# EAGLE design moc (EAGLE 8.6.2)
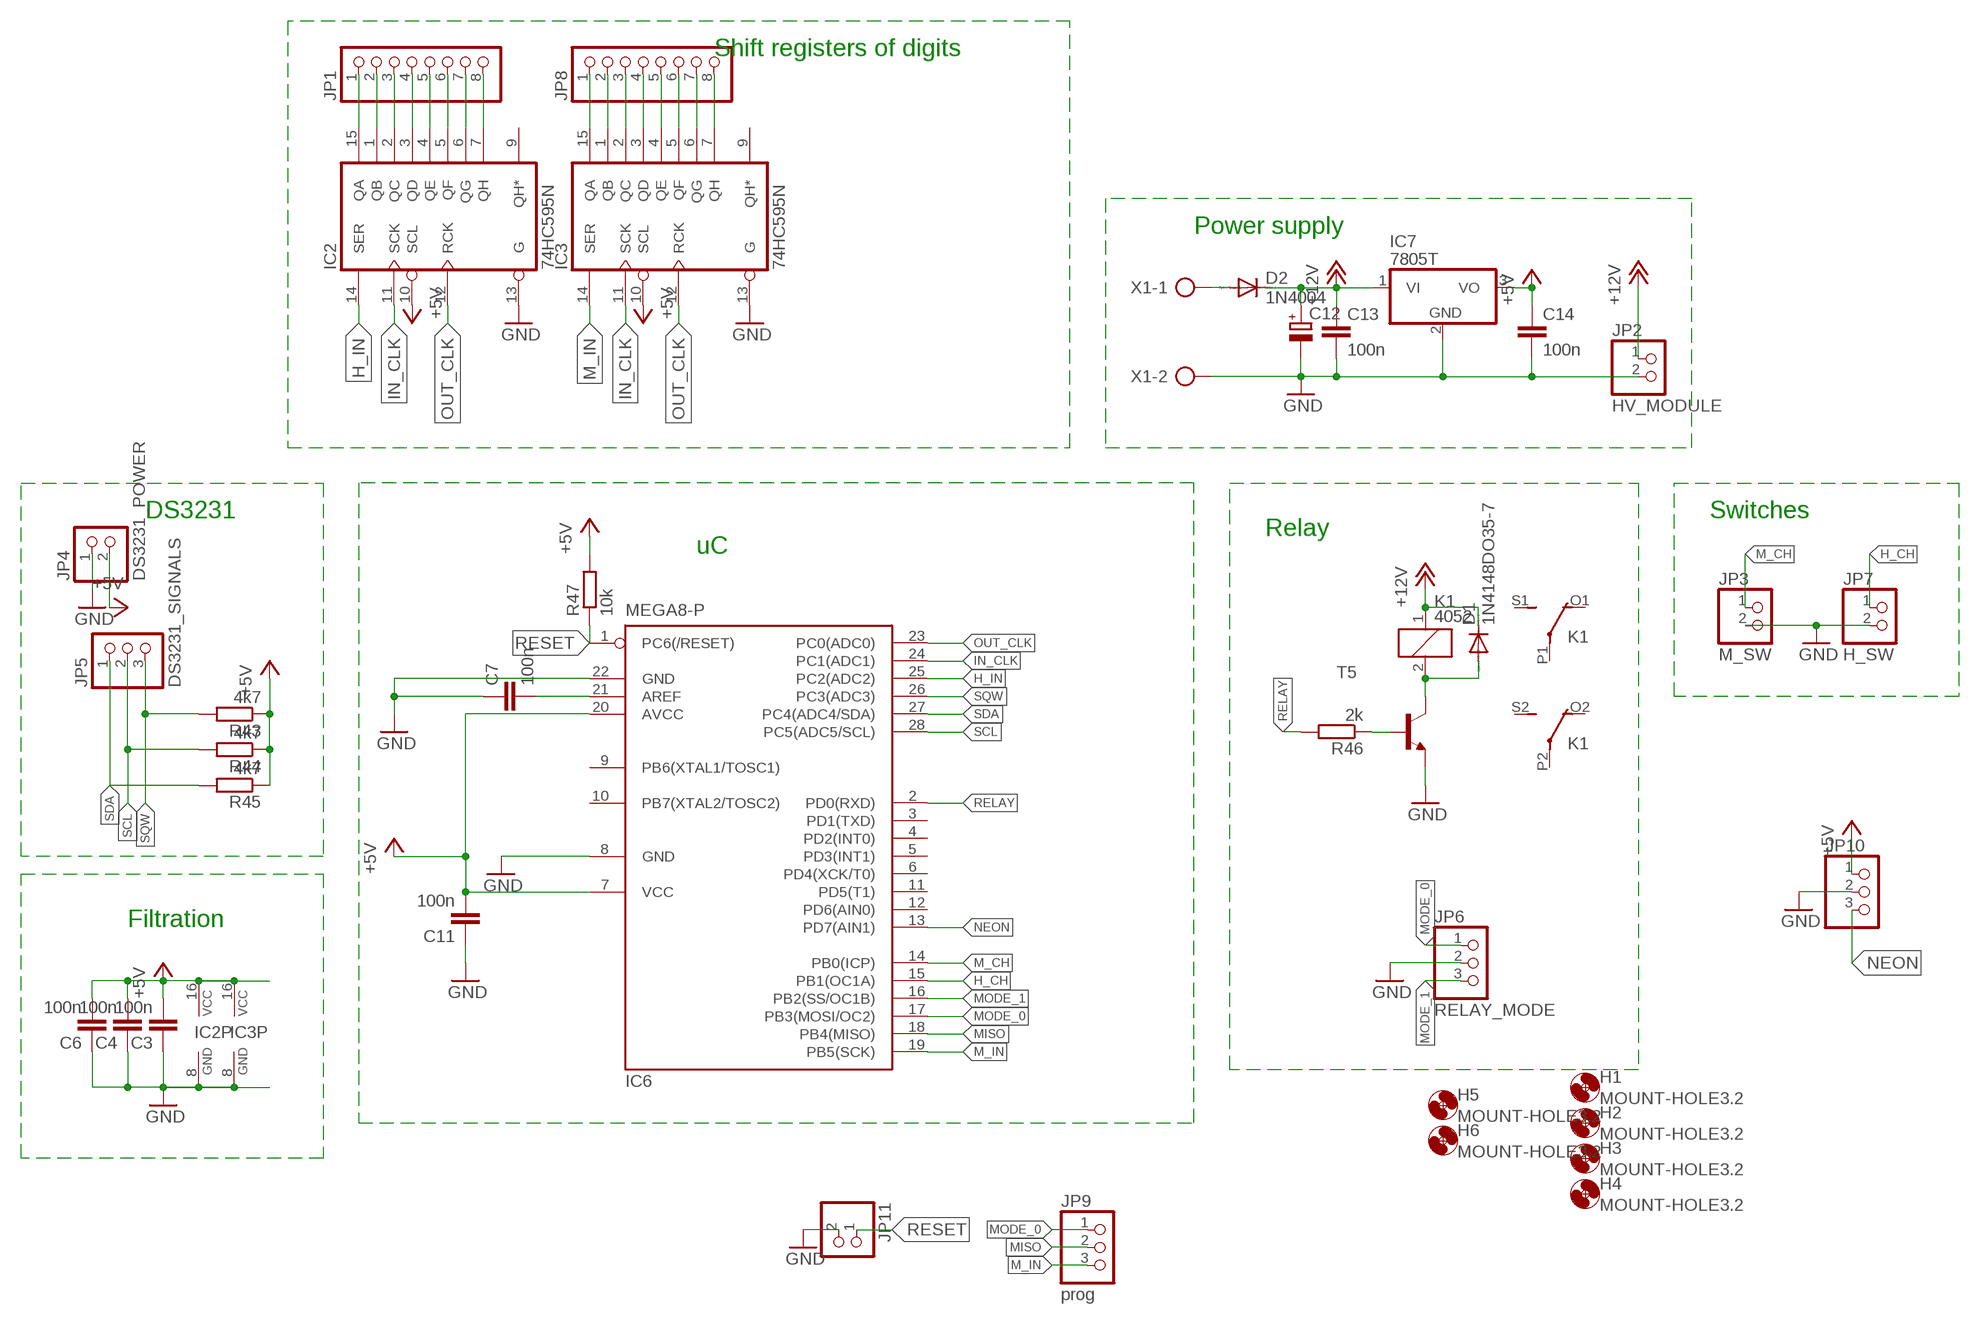
[diagram p0: schematic, sheet 1]

## Parts
C3  100n  C-EU025-025X050  [C025-025X050]
C4  100n  C-EU025-025X050  [C025-025X050]
C6  100n  C-EU025-025X050  [C025-025X050]
C7  100n  C-EU025-025X050  [C025-025X050]
C11  100n  C-EU025-025X050  [C025-025X050]
C12  CPOL-EUE3.5-8  [E3,5-8]
C13  100n  C-EU025-025X050  [C025-025X050]
C14  100n  C-EU025-025X050  [C025-025X050]
D1  1N4148DO35-7  [DO35-7]
D2  1N4004  [DO41-10]
H1  MOUNT-HOLE3.2  [3,2]
H2  MOUNT-HOLE3.2  [3,2]
H3  MOUNT-HOLE3.2  [3,2]
H4  MOUNT-HOLE3.2  [3,2]
H5  MOUNT-HOLE3.2  [3,2]
H6  MOUNT-HOLE3.2  [3,2]
IC2  74HC595N  [DIL16]
IC3  74HC595N  [DIL16]
IC6  MEGA8-P  [DIL28-3]
IC7  7805T  [TO220H]
JP1  PINHD-1X8  [1X08]
JP2  HV_MODULE  PINHD-1X2  [1X02]
JP3  M_SW  PINHD-1X2  [1X02]
JP4  DS3231_POWER  PINHD-1X2  [1X02]
JP5  DS3231_SIGNALS  PINHD-1X3  [1X03]
JP6  RELAY_MODE  PINHD-1X3  [1X03]
JP7  H_SW  PINHD-1X2  [1X02]
JP8  PINHD-1X8  [1X08]
JP9  prog  PINHD-1X3  [1X03]
JP10  PINHD-1X3  [1X03]
JP11  PINHD-1X2/90  [1X02/90]
K1  4052  [F4052]
R43  4k7  R-EU_0207/10  [0207/10]
R44  4k7  R-EU_0207/10  [0207/10]
R45  4k7  R-EU_0207/10  [0207/10]
R46  2k  R-EU_0207/7  [0207/7]
R47  10k  R-EU_0207/10  [0207/10]
T5  BC337-16-NPN-TO92-CBE  [TO92-CBE]
X1  AK300/2  [AK300/2]

## Nets
+5V: C3.2 C4.2 C6.2 C11.2 C14.1 IC2.10(SCL) IC2.16(VCC) IC3.10(SCL) IC3.16(VCC) IC6.7(VCC) IC6.20(AVCC) IC7.3(VO) JP4.2 JP10.1 R43.1 R44.1 R45.1 R47.2
+12V: C12.+ C13.1 D1.C D2.C IC7.1(VI) JP2.1 K1.1
D8: IC3.7(QH) JP8.8
D9: IC3.6(QG) JP8.7
D10: IC3.5(QF) JP8.6
D11: IC3.4(QE) JP8.5
D12: IC3.3(QD) JP8.4
D13: IC3.2(QC) JP8.3
D14: IC3.1(QB) JP8.2
D15: IC3.15(QA) JP8.1
D16: IC2.7(QH) JP1.8
D17: IC2.6(QG) JP1.7
D18: IC2.5(QF) JP1.6
D19: IC2.4(QE) JP1.5
D20: IC2.3(QD) JP1.4
D21: IC2.2(QC) JP1.3
D22: IC2.1(QB) JP1.2
D23: IC2.15(QA) JP1.1
GND: C3.1 C4.1 C6.1 C7.1 C11.1 C12.- C13.2 C14.2 IC2.8(GND) IC2.13(G) IC3.8(GND) IC3.13(G) IC6.8(GND) IC6.22(GND) IC7.2(GND) JP2.2 JP3.2 JP4.1 JP6.2 JP7.2 JP10.2 JP11.2 T5.E X1.2
H_CH: IC6.15(PB1(OC1A)) JP7.1
H_IN: IC2.14(SER) IC6.25(PC2(ADC2))
IN_CLK: IC2.11(SCK) IC3.11(SCK) IC6.24(PC1(ADC1))
M_CH: IC6.14(PB0(ICP)) JP3.1
M_IN: IC3.14(SER) IC6.19(PB5(SCK)) JP9.3
MISO: IC6.18(PB4(MISO)) JP9.2
MODE_0: IC6.17(PB3(MOSI/OC2)) JP6.1 JP9.1
MODE_1: IC6.16(PB2(SS/OC1B)) JP6.3
N$11: D2.A X1.1
N$43: C7.2 IC6.21(AREF)
N$53: D1.A K1.2 T5.C
N$54: R46.1 T5.B
NEON: IC6.13(PD7(AIN1)) JP10.3
OUT_CLK: IC2.12(RCK) IC3.12(RCK) IC6.23(PC0(ADC0))
RELAY: IC6.2(PD0(RXD)) R46.2
RESET: IC6.1(PC6(/RESET)) JP11.1 R47.1
SCL: IC6.28(PC5(ADC5/SCL)) JP5.2 R44.2
SDA: IC6.27(PC4(ADC4/SDA)) JP5.1 R45.2
SQW: IC6.26(PC3(ADC3)) JP5.3 R43.2
Unconnected: IC2.9(QH*) IC3.9(QH*) IC6.3(PD1(TXD)) IC6.4(PD2(INT0)) IC6.5(PD3(INT1)) IC6.6(PD4(XCK/T0)) IC6.9(PB6(XTAL1/TOSC1)) IC6.10(PB7(XTAL2/TOSC2)) IC6.11(PD5(T1)) IC6.12(PD6(AIN0)) K1.O1(2:O) K1.O2(3:O) K1.P1(2:P) K1.P2(3:P) K1.S1(2:S) K1.S2(3:S)

## Notes on the sheet
- Shift registers of digits
- Power supply
- DS3231 | Switches
- Relay
- uC
- Filtration

## Library data of the parts
C3 C4 C6 C7 C11 C13 C14 = resistor:C-EU: CAPACITOR, European symbol
C12 = resistor:CPOL-EU: POLARIZED CAPACITOR, European symbol
D1 = diode:1N4148: DIODE high speed (Philips)
D2 = diode:1N4004: DIODE general purpose rectifier, 1 A
H1-H6 = holes:MOUNT-HOLE: MOUNTING HOLE with drill center marker
IC2 IC3 = 74xx-eu:74*595: 8-bit SHIFT REGISTER, output latch
IC6 = atmel:MEGA8-P: MICROCONTROLLER 8 Kbytes FLASH, 1 kbytes SRAM, 512 bytes EEPROM, USART, 4-channel 10 bit ADC, 2-channel 8 bit ADC Pin compatible with Atmega48, ATMega88, ATMega168 Source: avr.lbr; OC_FARNELL: unknown; OC_NEWARK: unknown
IC7 = linear:78*: Positive VOLTAGE REGULATOR Source: http://cache.national.com/ds/LM/LM78L05.pdf http://www.fairchildsemi.com/ds/LM/LM7805.pdf
JP1 JP8 = pinhead:PINHD-1X8: PIN HEADER
JP2-JP4 JP7 JP11 = pinhead:PINHD-1X2: PIN HEADER
JP5 JP6 JP9 JP10 = pinhead:PINHD-1X3: PIN HEADER
K1 = relay:4052: RELAY 2 x switch, Finder; OC_FARNELL: unknown; OC_NEWARK: unknown
R43-R47 = resistor:R-EU_: RESISTOR, European symbol
T5 = transistor:*-NPN-: NPN Transistror BF959 corrected 2008.03.06
X1 = con-ptr500:AK300/2: CONNECTOR; OC_FARNELL: unknown; OC_NEWARK: unknown

## Board
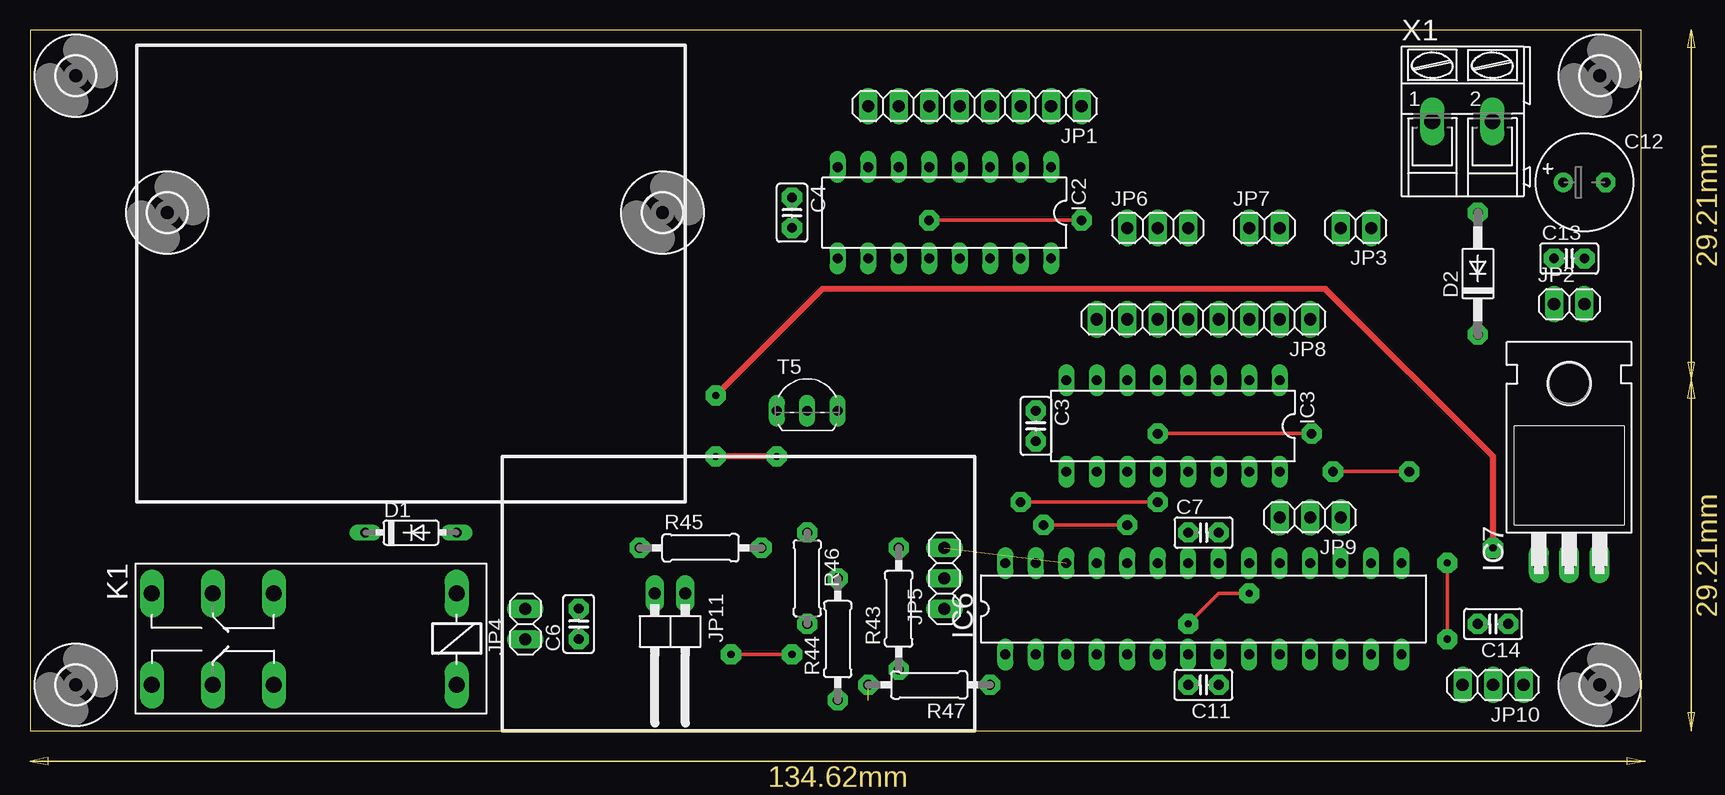
[diagram p1: board, top side]
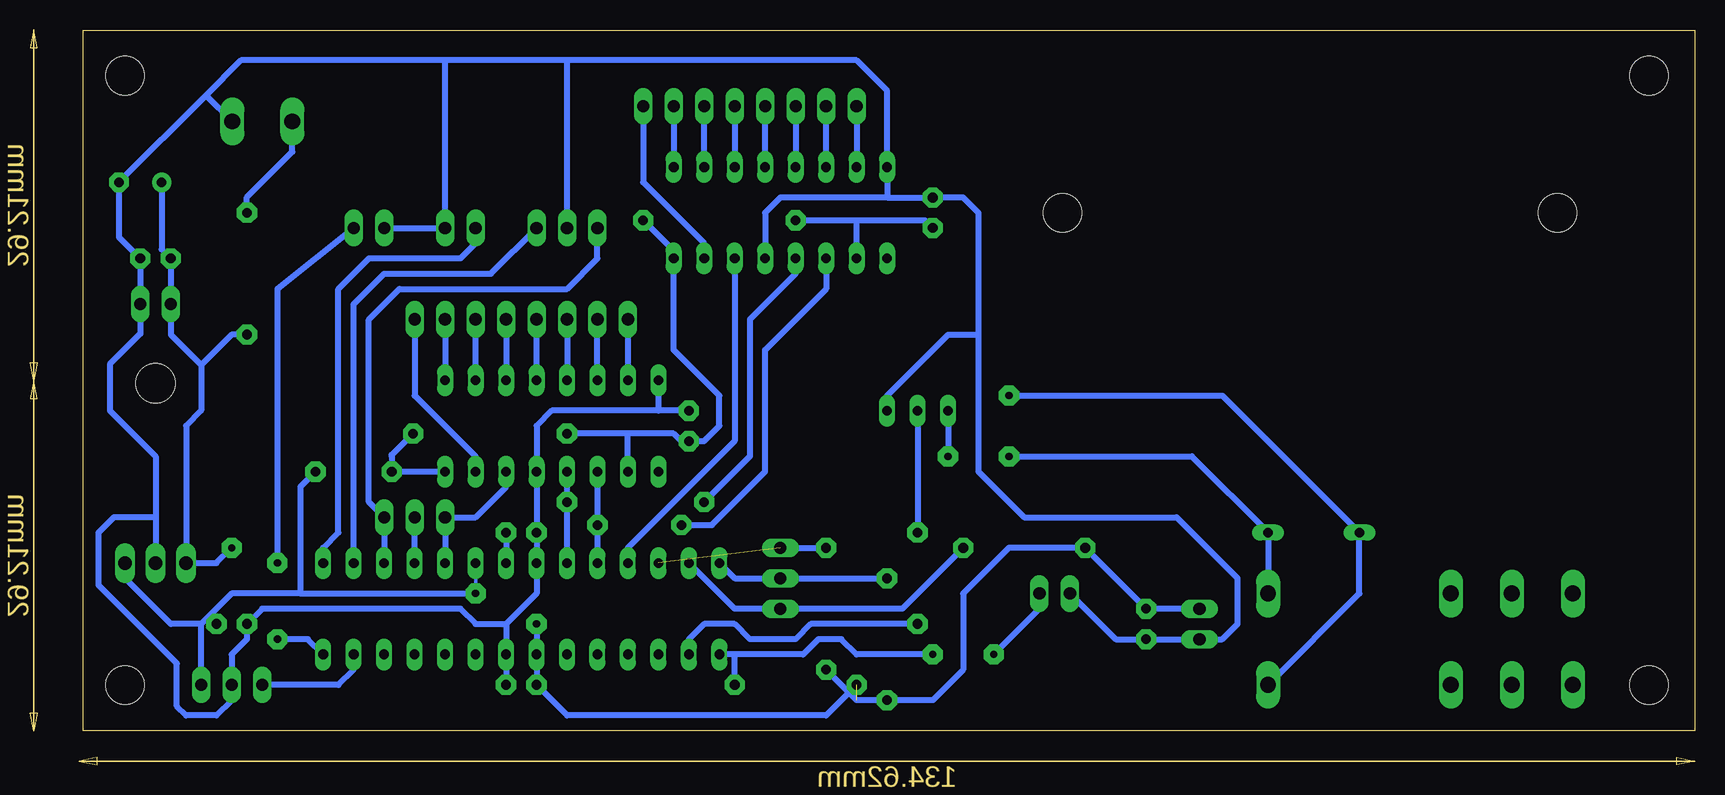
[diagram p2: board, bottom side, seen from below]

Size 134.29 x 58.41 mm. Coordinates in mm from the lower left corner, seen from the top.
Outline: 0,0 134.29,0 134.29,58.41 0,58.41 0,0
Copper layers (1*16): Top 0.035mm / dielectric 1.5mm / Bottom 0.035mm
Design rules "default": minimum track width 6mil, minimum drill 0.35mm, track to track 6mil, track to pad 6mil, pad to pad 6mil, via to via 6mil, smd to smd 6mil, copper to edge 40mil, drill to drill 6mil, minimum pad ring 10mil, minimum via ring 8mil, stop-mask expansion 4mil, vias tented up to drill 0mil, thermal gap 10mil

### Footprints (pad centres in the part's own frame; a part is rotated, then mirrored left to right if it is on the bottom)
C025-025X050 = drill 0.813 pad 1.676 octagon: 1 -1.27,0; 2 1.27,0
E3,5-8 = drill 0.813 pad 1.6: + -1.778,0 | drill 0.813 pad 1.6 octagon: - 1.778,0
DO35-7 = drill 0.813 long: A 3.81,0; C -3.81,0
DO41-10 = drill 0.8 pad 1.676 octagon: A 5.08,0; C -5.08,0
3,2 = hole 3.2: 0,0
DIL16 = drill 0.813 long: 1 -8.89,-3.81; 2 -6.35,-3.81; 3 -3.81,-3.81; 4 -1.27,-3.81; 5 1.27,-3.81; 6 3.81,-3.81; 7 6.35,-3.81; 8 8.89,-3.81; 9 8.89,3.81; 10 6.35,3.81; 11 3.81,3.81; 12 1.27,3.81; 13 -1.27,3.81; 14 -3.81,3.81; 15 -6.35,3.81; 16 -8.89,3.81
DIL28-3 = drill 0.813 long: 1 -16.51,-3.81; 2 -13.97,-3.81; 3 -11.43,-3.81; 4 -8.89,-3.81; 5 -6.35,-3.81; 6 -3.81,-3.81; 7 -1.27,-3.81; 8 1.27,-3.81; 9 3.81,-3.81; 10 6.35,-3.81; 11 8.89,-3.81; 12 11.43,-3.81; 13 13.97,-3.81; 14 16.51,-3.81; 15 16.51,3.81; 16 13.97,3.81; 17 11.43,3.81; 18 8.89,3.81; 19 6.35,3.81; 20 3.81,3.81; 21 1.27,3.81; 22 -1.27,3.81; 23 -3.81,3.81; 24 -6.35,3.81; 25 -8.89,3.81; 26 -11.43,3.81; 27 -13.97,3.81; 28 -16.51,3.81
TO220H = drill 1.118 long: 1 -2.54,-10.16; 2 0,-10.16; 3 2.54,-10.16 | hole 3.302: 0,4.826
1X08 = drill 1.016 long: 1 -8.89,0; 2 -6.35,0; 3 -3.81,0; 4 -1.27,0; 5 1.27,0; 6 3.81,0; 7 6.35,0; 8 8.89,0
1X02 = drill 1.016 long: 1 -1.27,0; 2 1.27,0
1X03 = drill 1.016 long: 1 -2.54,0; 2 0,0; 3 2.54,0
1X02/90 = drill 1.016 long: 1 -1.27,-3.81; 2 1.27,-3.81
F4052 = drill 1.321 long: 1 -3.81,3.81; 2 -3.81,-3.81; O1 11.43,-3.81; O2 11.43,3.81; P1 16.51,-3.81; P2 16.51,3.81; S1 21.59,-3.81; S2 21.59,3.81
0207/10 = drill 0.813 pad 1.676 octagon: 1 -5.08,0; 2 5.08,0
0207/7 = drill 0.813 pad 1.676 octagon: 1 -3.81,0; 2 3.81,0
TO92-CBE = drill 0.813 long: B 0,0; C -2.54,0; E 2.54,0
AK300/2 = drill 1.321 long: 1 -2.515,0; 2 2.489,0

### Placement (x,y rotation side)
C3  83.82,25.4 270 top
C4  63.5,43.18 270 top
C6  45.72,8.89 90 top
C7  97.79,16.51 0 top
C11  97.79,3.81 180 top
C12  129.54,45.72 0 top
C13  128.27,39.37 0 top
C14  121.92,8.89 180 top
D1  31.75,16.51 0 top
D2  120.65,38.1 90 top
H1  130.81,3.81 0 top
H2  130.81,54.61 0 top
H3  52.7,43.18 0 top
H4  11.43,43.18 0 top
H5  3.81,3.81 0 top
H6  3.81,54.61 0 top
IC2  76.2,43.18 180 top
IC3  95.25,25.4 180 top
IC6  97.79,10.16 0 top
IC7  128.27,24.13 0 top
JP1  78.74,52.07 180 top
JP2  128.27,35.56 0 top
JP3  110.49,41.91 180 top
JP4  41.27,8.89 90 top
JP5  76.2,12.7 90 top
JP6  93.98,41.91 0 top
JP7  102.87,41.91 0 top
JP8  97.79,34.29 180 top
JP9  106.68,17.78 180 top
JP10  121.92,3.81 180 top
JP11  53.34,7.62 180 top
K1  31.75,7.62 180 top
R43  72.39,10.16 90 top
R44  67.31,7.62 90 top
R45  55.88,15.24 0 top
R46  64.77,12.7 270 top
R47  74.93,3.81 180 top
T5  64.77,26.67 0 top
X1  119.38,50.8 0 top

### Tracks (layer width: path | path; a pad name or v marks a point on that pad's centre or on a via)
+5V  (via drill 0.6 pad 1.68, 0.8 pad 1.68)  (1 unrouted)
  Top 0.305: v96.52,8.89 99.06,11.43 v101.6,11.43 | v108.59,21.59 v114.94,21.59 | v93.98,24.77 v106.81,24.77 | v74.93,42.54 v87.63,42.54
  Bottom 0.305: v101.6,11.43 IC6.20 | 88.9,22.86 IC3.10 | 108.59,22.99 108.59,22.86
  Bottom 0.508: 88.9,24.77 85.09,24.77 84.45,24.13 C3.2 82.55,24.13 81.28,25.4 81.28,27.94 85.09,31.75 IC2.16 85.09,40 v87.63,42.54 | 88.9,24.77 v93.98,24.77 | v106.81,24.77 108.59,22.99 | 108.59,22.86 v108.59,21.59 IC3.16 | v114.94,21.59 116.21,20.32 116.21,11.43 | 116.21,11.43 v101.6,11.43 | v96.52,8.89 IC6.7 C11.2 93.98,1.27 72.39,1.27 R47.2 | v74.93,42.54 69.85,42.54 | 116.21,11.43 121.92,11.43 123.82,9.53 | R43.1 69.85,2.54 R44.1 63.5,2.54 60.96,5.08 60.96,11.43 57.15,15.24 R45.1 C6.2 JP4.2 | IC2.10 69.85,42.54 | IC3.10 88.9,24.77 | IC7.3 130.81,12.7 127,8.89 124.46,8.89 | C4.2 64.13,42.54 69.85,42.54 | 124.46,8.89 123.82,9.53 | JP10.1 124.46,8.89 | C14.1 123.82,9.53
+12V  (via drill 0.6 pad 1.68)
  Top 0.508: v121.92,15.24 121.92,22.86 107.95,36.83 66.04,36.83 v57.15,27.94
  Bottom 0.508: K1.1 27.94,11.43 D1.C 39.37,27.94 v57.15,27.94 | v121.92,15.24 123.19,13.97 IC7.1 125.73,25.4 124.46,26.67 124.46,30.48 | 124.46,30.48 127,33.02 JP2.1 C13.1 127.76,40.13 C12.+ | D2.C 121.92,33.02 124.46,30.48
D8
  Bottom 0.508: JP8.8 IC3.7
D9
  Bottom 0.508: IC3.6 JP8.7
D10
  Bottom 0.508: JP8.6 IC3.5
D11
  Bottom 0.508: IC3.4 JP8.5
D12
  Bottom 0.508: JP8.4 IC3.3
D13
  Bottom 0.508: IC3.2 JP8.3
D14
  Bottom 0.508: JP8.2 IC3.1
D15
  Bottom 0.508: JP8.1 106.68,27.94 101.6,22.86 IC3.15
D16
  Bottom 0.508: JP1.8 IC2.7
D17
  Bottom 0.508: IC2.6 JP1.7
D18
  Bottom 0.508: JP1.6 IC2.5
D19
  Bottom 0.508: IC2.4 JP1.5
D20
  Bottom 0.508: JP1.4 IC2.3
D21
  Bottom 0.508: IC2.2 JP1.3
D22
  Bottom 0.508: JP1.2 IC2.1
D23
  Bottom 0.508: JP1.1 87.63,45.72 82.55,40.64 IC2.15
GND
  Bottom 0.305: IC3.8 86.36,27.94
  Bottom 0.508: X1.2 121.92,50.75 | X1.2 121.87,50.85 | 67.31,44.45 IC2.8 67.31,53.34 69.85,55.88 93.98,55.88 | 67.31,44.45 C4.1 60.96,44.45 59.69,43.18 59.69,33.02 | 99.06,8.89 101.6,8.89 102.87,10.16 119.38,10.16 C14.2 120.65,7.62 121.92,6.35 JP10.2 121.92,2.54 123.19,1.27 125.73,1.27 126.49,2.03 126.49,5.6 133.02,12.13 133.02,16.51 131.75,17.78 128.27,17.78 | 99.06,8.89 IC6.8 C11.1 | 99.06,8.89 96.52,11.43 IC6.22 C7.1 IC3.13 96.52,25.4 95.25,26.67 86.36,26.67 | C3.1 86.36,26.67 | IC3.8 86.36,26.67 | 67.31,44.45 76.2,44.45 77.47,43.18 IC2.13 | 128.27,17.78 IC7.2 | JP11.2 48.26,7.62 C6.1 JP4.1 39.37,7.62 38.1,8.89 38.1,12.7 43.18,17.78 55.88,17.78 59.69,21.59 59.69,33.02 | T5.E 67.31,27.94 62.23,33.02 59.69,33.02 | 124.08,52.96 C12.- 131.32,41.15 C13.2 JP2.2 129.54,33.09 132.08,30.55 132.08,26.67 128.27,22.86 128.27,17.78 | 124.08,52.96 121.16,55.88 104.14,55.88 | X1.2 124.03,52.96 124.08,52.96 | 93.98,55.88 104.14,55.88 | 104.14,55.88 JP7.2 JP3.2 | JP6.2 93.98,55.88
H_CH
  Bottom 0.508: IC6.15 114.3,15.24 113.03,16.51 113.03,36.83 110.49,39.37 102.87,39.37 101.6,40.64 JP7.1
H_IN
  Bottom 0.508: IC2.14 80.01,24.13 88.9,15.24 IC6.25
IN_CLK  (via drill 0.8 pad 1.68)
  Top 0.305: v84.45,17.14 v91.44,17.14
  Bottom 0.305: 91.44,16.51 IC6.24 | 84.96,17.14 v84.45,17.14
  Bottom 0.508: v84.45,17.14 81.91,17.14 77.47,21.59 77.47,31.75 72.39,36.83 IC2.11 | IC3.11 91.44,16.51 | v91.44,17.14 IC6.24
M_CH  (via drill 0.6 pad 1.68)
  Top 0.305: v118.11,7.62 v118.11,13.97
  Bottom 0.508: IC6.14 115.57,7.62 v118.11,7.62 | JP3.1 118.11,36.83 v118.11,13.97
M_IN
  Bottom 0.305: IC3.14 99.06,20.45
  Bottom 0.508: IC6.19 JP9.3 101.6,17.78 99.06,20.32 IC3.14
MISO
  Bottom 0.508: IC6.18 JP9.2
MODE_0
  Bottom 0.508: IC6.17 JP9.1 110.49,19.05 110.49,34.29 107.95,36.83 93.98,36.83 91.44,39.37 JP6.1
MODE_1
  Bottom 0.508: IC6.16 111.76,35.56 109.22,38.1 100.33,38.1 JP6.3
N$11
  Bottom 0.508: 116.87,48.23 116.87,48.26 | 116.87,48.26 X1.1 | D2.A 120.65,44.47 116.87,48.26
N$43
  Bottom 0.508: C7.2 IC6.21
N$53  (via drill 0.6 pad 1.68)
  Top 0.508: v62.23,22.86 v57.15,22.86
  Bottom 0.508: K1.2 D1.A 41.91,22.86 v57.15,22.86 | T5.C v62.23,22.86
N$54
  Bottom 0.508: T5.B R46.1
NEON
  Bottom 0.508: IC6.13 111.76,5.08 113.03,3.81 JP10.3
OUT_CLK  (via drill 0.8 pad 1.68)
  Top 0.305: 82.42,19.05 v82.55,19.05 v93.98,19.05
  Bottom 0.508: IC2.12 74.93,38.1 78.74,34.29 78.74,22.86 v82.55,19.05 | IC6.23 v93.98,19.05 IC3.12
RELAY
  Bottom 0.508: R46.2 73.66,8.89 74.93,7.62 78.74,7.62 80.01,8.89 82.55,8.89 83.82,7.62 IC6.2
RESET  (via drill 0.6 pad 1.68)
  Top 0.305: v63.5,6.35 v58.42,6.35
  Bottom 0.508: JP11.1 54.61,10.16 v58.42,6.35 | v63.5,6.35 69.85,6.35 71.12,7.62 73.03,7.62 74.3,6.35 80.01,6.35 | 80.01,6.35 IC6.1 | R47.1 80.01,6.35
SCL
  Bottom 0.508: R44.2 JP5.2 80.01,12.7 IC6.28
SDA
  Bottom 0.508: R45.2 66.04,10.16 JP5.1 80.01,10.16 IC6.27
SQW  (1 unrouted)
  Bottom 0.508: JP5.3 R43.2